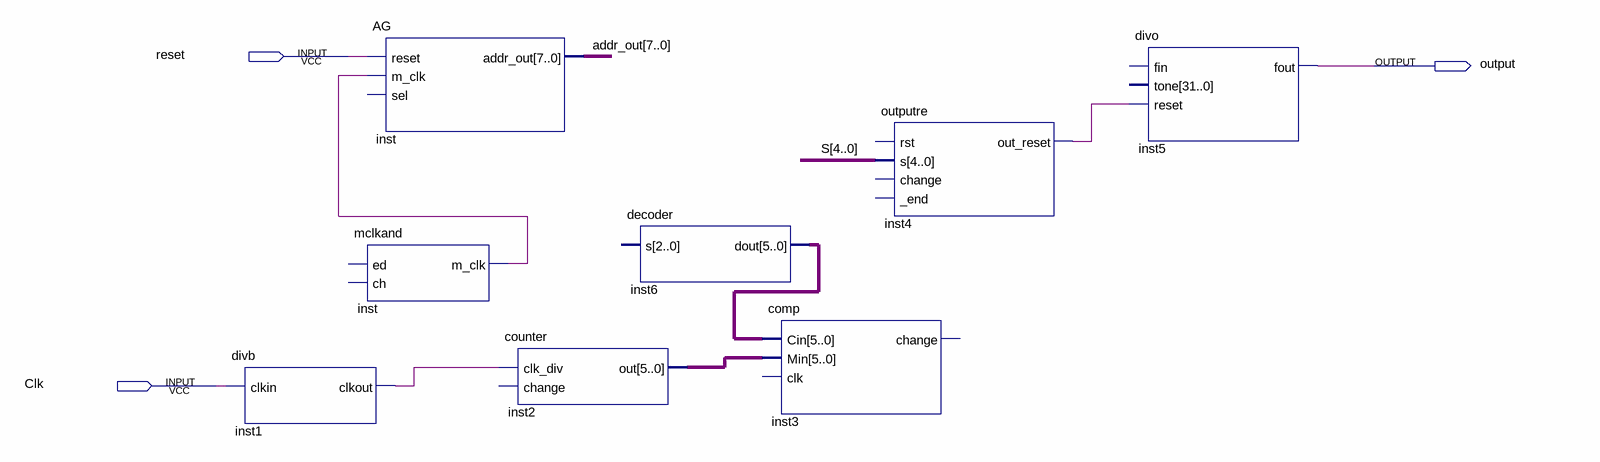
[diagram p0: schematic sheet]
// Quartus schematic lab3.bdf as structural Verilog: 8 symbols, 3 pins
module lab3 (
  input  reset,
  input  Clk,
  output \output 
);

  wire inst1_clkout, inst4_out_reset, inst_m_clk;
  wire [4:0] S;
  wire [5:0] inst2_out, inst6_dout;
  wire [7:0] addr_out;

  divb inst1 (.clkin(Clk), .clkout(inst1_clkout));
  AG inst (.reset(reset), .m_clk(inst_m_clk), .addr_out(addr_out));  // open: sel
  mclkand inst_dup2 (.m_clk(inst_m_clk));  // open: ed, ch
  counter inst2 (.clk_div(inst1_clkout), .out(inst2_out));  // open: change
  decoder inst6 (.dout(inst6_dout));  // open: s
  comp inst3 (.Cin(inst6_dout), .Min(inst2_out));  // open: clk, change
  outputre inst4 (.s(S), .out_reset(inst4_out_reset));  // open: rst, change, _end
  divo inst5 (.reset(inst4_out_reset), .fout(\output ));  // open: fin, tone
endmodule
